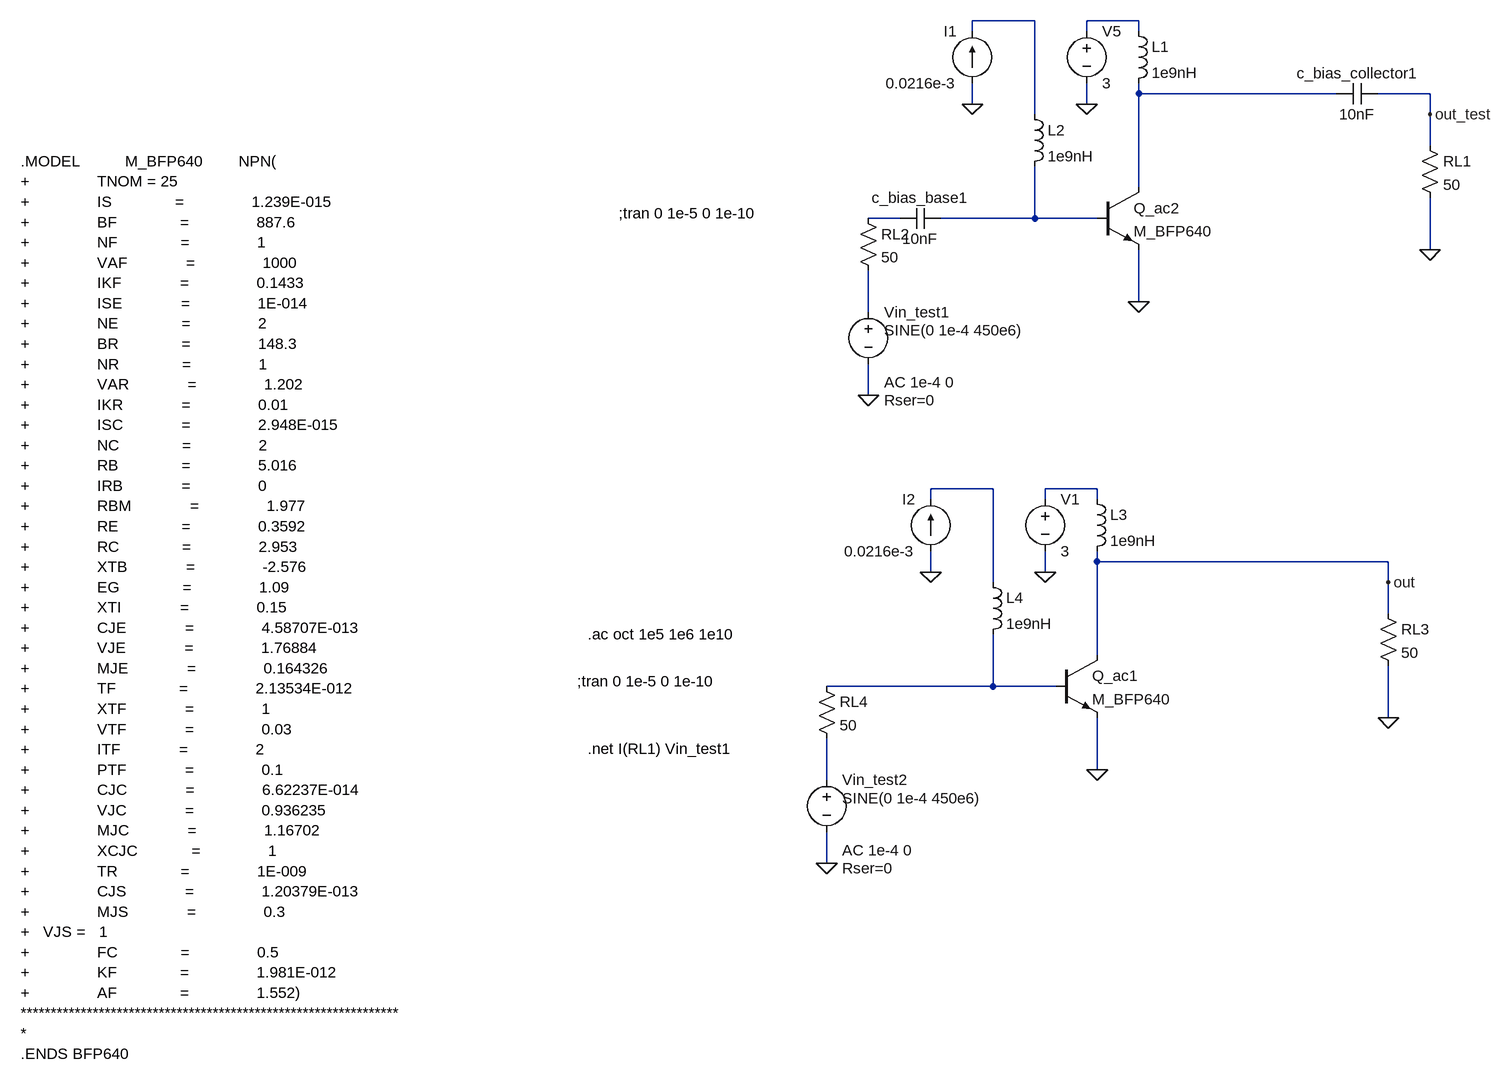
[diagram p0: schematic BFP640_NOISE_TEST.asc]
BFP640_NOISE_TEST.asc, the LTspice schematic file:
Version 4
SHEET 1 1100 5000
WIRE 272 3536 176 3536
WIRE 432 3536 352 3536
WIRE 176 3552 176 3536
WIRE 352 3552 352 3536
WIRE 432 3552 432 3536
WIRE 432 3648 432 3632
WIRE 736 3648 432 3648
WIRE 880 3648 800 3648
WIRE 176 3664 176 3632
WIRE 352 3664 352 3632
WIRE 272 3680 272 3536
WIRE 880 3680 880 3648
WIRE 880 3728 880 3680
WIRE 432 3792 432 3648
WIRE 64 3840 16 3840
WIRE 272 3840 272 3760
WIRE 272 3840 128 3840
WIRE 368 3840 272 3840
WIRE 880 3888 880 3808
WIRE 432 3968 432 3888
WIRE 16 3984 16 3920
WIRE 16 4112 16 4064
WIRE 208 4256 112 4256
WIRE 368 4256 288 4256
WIRE 112 4272 112 4256
WIRE 288 4272 288 4256
WIRE 368 4272 368 4256
WIRE 368 4368 368 4352
WIRE 816 4368 368 4368
WIRE 112 4384 112 4352
WIRE 288 4384 288 4352
WIRE 208 4400 208 4256
WIRE 816 4400 816 4368
WIRE 816 4448 816 4400
WIRE 368 4512 368 4368
WIRE 208 4560 208 4480
WIRE 208 4560 -48 4560
WIRE 304 4560 208 4560
WIRE 816 4608 816 4528
WIRE 368 4688 368 4608
WIRE -48 4704 -48 4640
WIRE -48 4832 -48 4784
FLAG 432 3968 0
FLAG 880 3888 0
FLAG 16 4112 0
FLAG 176 3664 0
FLAG 352 3664 0
FLAG 880 3680 out_test
FLAG 368 4688 0
FLAG 816 4608 0
FLAG -48 4832 0
FLAG 112 4384 0
FLAG 288 4384 0
FLAG 816 4400 out
SYMBOL npn 368 3792 R0
SYMATTR InstName Q_ac2
SYMATTR Value M_BFP640
SYMBOL cap 128 3824 R90
WINDOW 0 0 32 VBottom 2
WINDOW 3 32 32 VTop 2
SYMATTR InstName c_bias_base1
SYMATTR Value 10nF
SYMBOL voltage 16 3968 R0
WINDOW 123 24 124 Left 2
WINDOW 39 24 152 Left 2
WINDOW 3 24 44 Left 2
SYMATTR Value2 AC 1e-4 0
SYMATTR SpiceLine Rser=0
SYMATTR Value SINE(0 1e-4 450e6)
SYMATTR InstName Vin_test1
SYMBOL cap 800 3632 R90
WINDOW 0 0 32 VBottom 2
WINDOW 3 32 32 VTop 2
SYMATTR InstName c_bias_collector1
SYMATTR Value 10nF
SYMBOL res 864 3712 R0
SYMATTR InstName RL1
SYMATTR Value 50
SYMBOL voltage 352 3536 R0
WINDOW 123 0 0 Left 0
WINDOW 39 0 0 Left 0
SYMATTR InstName V5
SYMATTR Value 3
SYMBOL current 176 3632 R180
WINDOW 0 24 80 Left 2
WINDOW 3 24 0 Left 2
WINDOW 123 0 0 Left 0
WINDOW 39 0 0 Left 0
SYMATTR InstName I1
SYMATTR Value 0.0216e-3
SYMBOL ind 416 3536 R0
SYMATTR InstName L1
SYMATTR Value 1e9nH
SYMBOL ind 256 3664 R0
SYMATTR InstName L2
SYMATTR Value 1e9nH
SYMBOL res 0 3824 R0
SYMATTR InstName RL2
SYMATTR Value 50
SYMBOL npn 304 4512 R0
SYMATTR InstName Q_ac1
SYMATTR Value M_BFP640
SYMBOL voltage -48 4688 R0
WINDOW 123 24 124 Left 2
WINDOW 39 24 152 Left 2
WINDOW 3 24 44 Left 2
SYMATTR Value2 AC 1e-4 0
SYMATTR SpiceLine Rser=0
SYMATTR Value SINE(0 1e-4 450e6)
SYMATTR InstName Vin_test2
SYMBOL res 800 4432 R0
SYMATTR InstName RL3
SYMATTR Value 50
SYMBOL voltage 288 4256 R0
WINDOW 123 0 0 Left 0
WINDOW 39 0 0 Left 0
SYMATTR InstName V1
SYMATTR Value 3
SYMBOL current 112 4352 R180
WINDOW 0 24 80 Left 2
WINDOW 3 24 0 Left 2
WINDOW 123 0 0 Left 0
WINDOW 39 0 0 Left 0
SYMATTR InstName I2
SYMATTR Value 0.0216e-3
SYMBOL ind 352 4256 R0
SYMATTR InstName L3
SYMATTR Value 1e9nH
SYMBOL ind 192 4384 R0
SYMATTR InstName L4
SYMATTR Value 1e9nH
SYMBOL res -64 4544 R0
SYMATTR InstName RL4
SYMATTR Value 50
TEXT -368 3832 Left 2 !;tran 0 1e-5 0 1e-10
TEXT -432 4552 Left 2 !;tran 0 1e-5 0 1e-10
TEXT -416 4480 Left 2 !.ac oct 1e5 1e6 1e10
TEXT -416 4656 Left 2 !.net I(RL1) Vin_test1
TEXT -1288 3752 Left 2 !.MODEL          M_BFP640        NPN(\n+               TNOM = 25\n+               IS              =               1.239E-015\n+               BF              =               887.6\n+               NF              =               1\n+               VAF             =               1000\n+               IKF             =               0.1433\n+               ISE             =               1E-014\n+               NE              =               2\n+               BR              =               148.3\n+               NR              =               1\n+               VAR             =               1.202\n+               IKR             =               0.01\n+               ISC             =               2.948E-015\n+               NC              =               2\n+               RB              =               5.016\n+               IRB             =               0\n+               RBM             =               1.977\n+               RE              =               0.3592\n+               RC              =               2.953\n+               XTB             =               -2.576\n+               EG              =               1.09\n+               XTI             =               0.15\n+               CJE             =               4.58707E-013\n+               VJE             =               1.76884\n+               MJE             =               0.164326\n+               TF              =               2.13534E-012\n+               XTF             =               1\n+               VTF             =               0.03\n+               ITF             =               2\n+               PTF             =               0.1\n+               CJC             =               6.62237E-014\n+               VJC             =               0.936235\n+               MJC             =               1.16702\n+               XCJC            =               1\n+               TR              =               1E-009\n+               CJS             =               1.20379E-013\n+               MJS             =               0.3\n+   VJS =   1\n+               FC              =               0.5\n+               KF              =               1.981E-012\n+               AF              =               1.552)\n***************************************************************\n*\n.ENDS BFP640

The netlist it stands for:
* BFP640_NOISE_TEST.asc
Q_ac2 N003 N005 0 0 M_BFP640
c_bias_base1 N005 N004 10nF
Vin_test1 N006 0 SINE(0 1e-4 450e6) AC 1e-4 0 Rser=0
c_bias_collector1 out_test N003 10nF
RL1 out_test 0 50
V5 N002 0 3
I1 0 N001 0.0216e-3
L1 N002 N003 1e9nH
L2 N001 N005 1e9nH
RL2 N004 N006 50
Q_ac1 out N009 0 0 M_BFP640
Vin_test2 N010 0 SINE(0 1e-4 450e6) AC 1e-4 0 Rser=0
RL3 out 0 50
V1 N008 0 3
I2 0 N007 0.0216e-3
L3 N008 out 1e9nH
L4 N007 N009 1e9nH
RL4 N009 N010 50
.model NPN NPN
.model PNP PNP
.lib standard.bjt
;tran 0 1e-5 0 1e-10
;tran 0 1e-5 0 1e-10
.ac oct 1e5 1e6 1e10
.net I(RL1) Vin_test1
.MODEL          M_BFP640        NPN(
+               TNOM = 25
+               IS              =               1.239E-015
+               BF              =               887.6
+               NF              =               1
+               VAF             =               1000
+               IKF             =               0.1433
+               ISE             =               1E-014
+               NE              =               2
+               BR              =               148.3
+               NR              =               1
+               VAR             =               1.202
+               IKR             =               0.01
+               ISC             =               2.948E-015
+               NC              =               2
+               RB              =               5.016
+               IRB             =               0
+               RBM             =               1.977
+               RE              =               0.3592
+               RC              =               2.953
+               XTB             =               -2.576
+               EG              =               1.09
+               XTI             =               0.15
+               CJE             =               4.58707E-013
+               VJE             =               1.76884
+               MJE             =               0.164326
+               TF              =               2.13534E-012
+               XTF             =               1
+               VTF             =               0.03
+               ITF             =               2
+               PTF             =               0.1
+               CJC             =               6.62237E-014
+               VJC             =               0.936235
+               MJC             =               1.16702
+               XCJC            =               1
+               TR              =               1E-009
+               CJS             =               1.20379E-013
+               MJS             =               0.3
+   VJS =   1
+               FC              =               0.5
+               KF              =               1.981E-012
+               AF              =               1.552)
***************************************************************
*
.ENDS BFP640
.backanno
.end